# Altium schematic sheet MCU_DLS.SchDoc: DLS MCU
size A3; DrawnBy: Artur Bereit; Revision: 1.0; SheetNumber: 3; SheetTotal: 4; SPICEModelCacheRWZWSWZR: <root> / <DocumentId>RWZWSWZR</DocumentId> / <CacheFrame Number="0"> / <Model Name="0805_150080gs75000" Kind="CKT"> / <Text>****** / .subckt 0805_150080GS75000  1  2 / D1 1 2 SMCW / .MODEL SMCW D / + IS=906.98E-12 / + N=4.4982 / + RS=1.5743 / + IKF=518.93E-9 / + CJO=1.0000E-12 / + M=.3333 / + VJ=.75 / + BV=5 / + IBV=10.00E-6 / + TT=5.0000E-9 / .ends</Text> / </Model> / <Model Name="0805_150080as75000" Kind="CKT"> / <Text>****** / .subckt 0805_150080AS75000  1  2 / D1 1 2 SMCW / .MODEL SMCW D / + IS=10.010E-21 / + N=1.8643 / + RS=1.0000E-6 / + IKF=999 / + CJO=1.0000E-12 / + M=.3333 / + VJ=.75 / + BV=5 / + IBV=10.00E-6 / + TT=5.0000E-9 / .ends</Text> / </Model> / <Model Name="860020672011_22uf" Kind="CKT"> / <Text>******* / .subckt 860020672011_22uF 1 2 / Rser 1 3 0.725557254649 / Lser 2 4 4.139560626E-09 / C1 3 4 0.000022 / Rpar 3 4 4545454.54545455 / .ends 860020672011_22uF</Text> / </Model> / </CacheFrame> / </root>
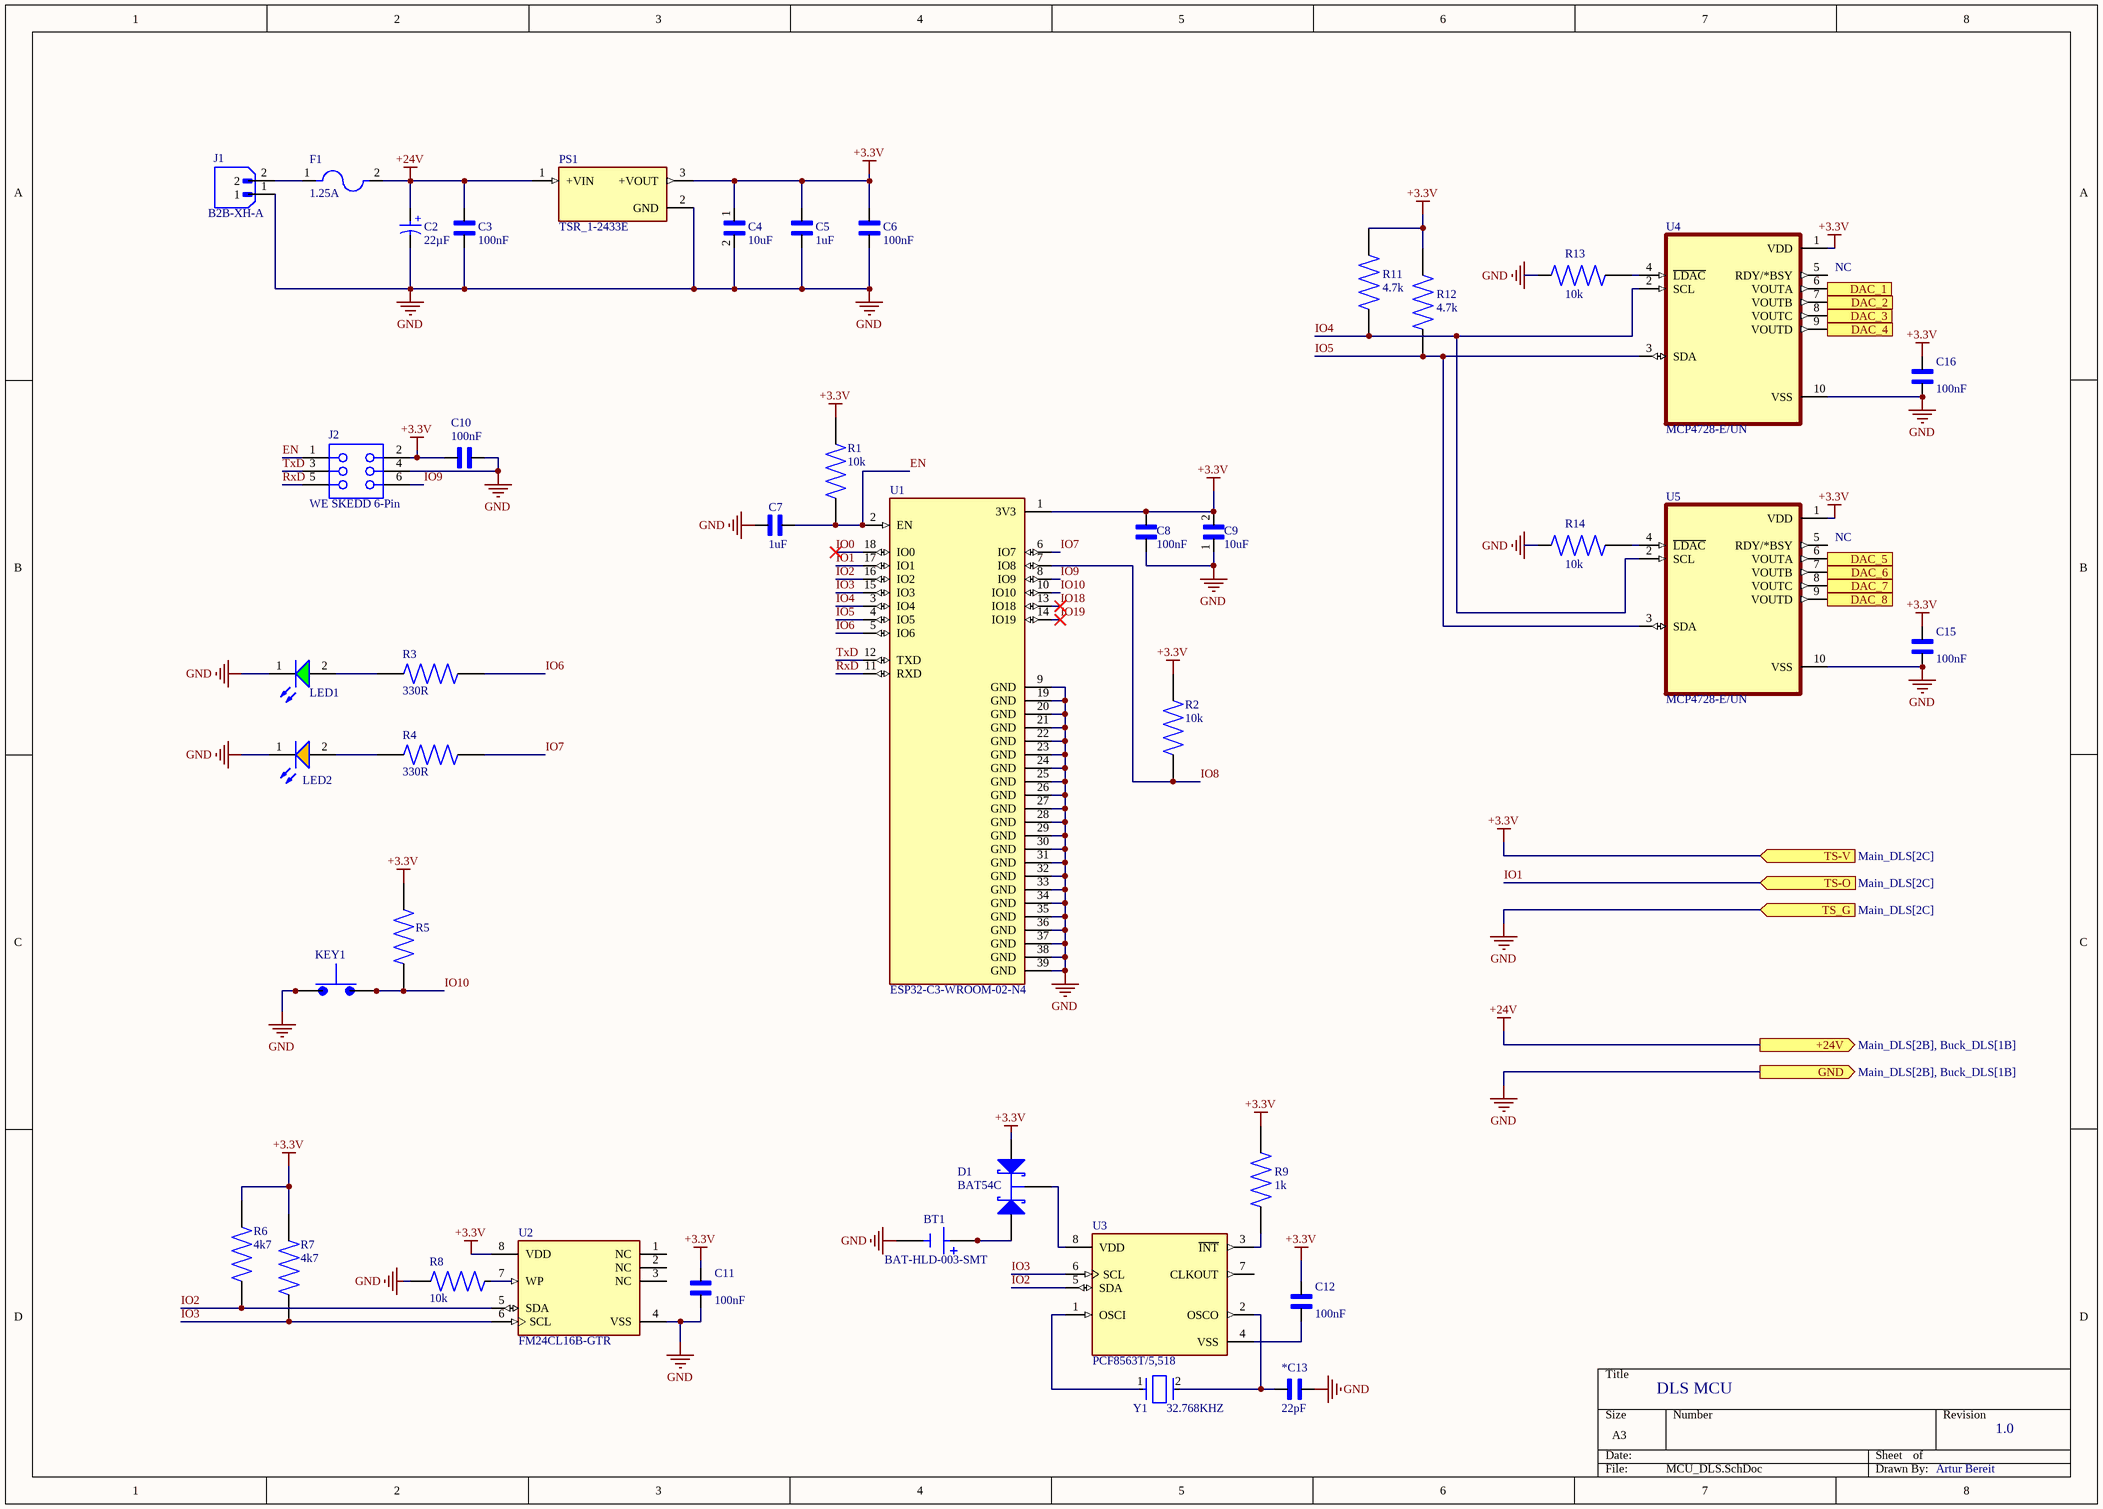
[diagram p0: MCU_DLS.SchDoc]

## Parts
*C13  22pF  [CAPC2012X94N]
BT1  BAT-HLD-003-SMT  [BAT_BAT-HLD-003-SMT]
C2  22µF  [WCAP-ATG5_D5H11]
C3  100nF  [CAPC2012X94N]
C4  10uF  [CAPC2012X145N]
C5  1uF  [CAPC2012X140N]
C6  100nF  [CAPC2012X94N]
C7  1uF  [CAPC2012X140N]
C8  100nF  [CAPC2012X94N]
C9  10uF  [CAPC2012X145N]
C10  100nF  [CAPC2012X94N]
C11  100nF  [CAPC2012X94N]
C12  100nF  [CAPC2012X94N]
C15  100nF  [CAPC2012X94N]
C16  100nF  [CAPC2012X94N]
D1  BAT54C  [NXP-SOT23-3_V]
F1  1.25A  [FUSC6125X279N]
J1  B2B-XH-A  [JST_B2B-XH-A_(LF)(SN)]
J2  WE SKEDD 6-Pin  [490107670612_Permanent Application]
KEY1  SKRPABE010  [SW_SKRPABE010]  (value not drawn)
LED1  Green  [WL-SMCW_0805_150080xx75000]  (value not drawn)
LED2  Amber, 2V, 140°  [WL-SMCW_0805_150080xx75000]  (value not drawn)
PS1  TSR_1-2433E  [CONV_TSR_1-2433E]
R1  10k  [RES_ERJ6ENF1002V]
R2  10k  [RES_ERJ6ENF1002V]
R3  330R  [RES_ERJ6ENF1002V]
R4  330R  [RES_ERJ6ENF1002V]
R5  ERJ6ENF1002V  [RES_ERJ6ENF1002V]  (value not drawn)
R6  4k7  [RES_ERJ6ENF1002V]
R7  4k7  [RES_ERJ6ENF1002V]
R8  10k  [RES_ERJ6ENF1002V]
R9  1k  [RES_ERJ6ENF1002V]
R11  4.7k  [RES_ERJ6ENF1002V]
R12  4.7k  [RES_ERJ6ENF1002V]
R13  10k  [RES_ERJ6ENF1002V]
R14  10k  [RES_ERJ6ENF1002V]
U1  ESP32-C3-WROOM-02-N4  [MODULE_ESP32-C3-WROOM-02-H4]
U2  FM24CL16B-GTR  [FP-51-85066-MFG]
U3  PCF8563T/5,518  [FP-SOT96-1-MFG]
U4  MCP4728-E/UN  [SOP50P490X110-10N]
U5  MCP4728-E/UN  [SOP50P490X110-10N]
Y1  32.768KHZ  [FP-ABS07-MFG]

## Ports
+24V (out, see Main_DLS[2B], Buck_DLS[1B]), DAC_1 (out, see Main_DLS[2B]), DAC_2 (out, see Main_DLS[2B]), DAC_3 (out, see Main_DLS[2B]), DAC_4 (out, see Main_DLS[2B]), DAC_5 (out, see Main_DLS[2B]), DAC_6 (out, see Main_DLS[2B]), DAC_7 (out, see Main_DLS[2C]), DAC_8 (out, see Main_DLS[2C]), GND (out, see Main_DLS[2B], Buck_DLS[1B]), TS-O (in, see Main_DLS[2C]), TS-V (in, see Main_DLS[2C]), TS_G (in, see Main_DLS[2C])

## Nets
+3.3V: C4.1 C5.2 C6.1 C8.2 C9.2 C10.1 C11.2 C12.2 C15.2 C16.2 D1.1(A) J2.2 PS1.3(+VOUT) R1.2 R2.2 R5.2 R6.1 R7.2 R9.2 R11.1 R12.1 U1.1(3V3) U2.8(VDD) U4.1(VDD) U5.1(VDD) ; port TS-V
+24V: C2.1(P) C3.2 F1.2 PS1.1(+VIN) ; port +24V
GND: *C13.1 BT1.N(NEG) C2.2(N) C3.1 C4.2 C5.1 C6.2 C7.1 C8.1 C9.1 C10.2 C11.1 C15.1 C16.1 J1.1 J2.4 KEY1.1 KEY1.2 LED1.1(K) LED2.1(K) PS1.2(GND) R8.1 R13.2 R14.2 U1.9(GND) U1.19(GND) U1.20(GND) U1.21(GND) U1.22(GND) U1.23(GND) U1.24(GND) U1.25(GND) U1.26(GND) U1.27(GND) U1.28(GND) U1.29(GND) U1.30(GND) U1.31(GND) U1.32(GND) U1.33(GND) U1.34(GND) U1.35(GND) U1.36(GND) U1.37(GND) U1.38(GND) U1.39(GND) U2.4(VSS) U4.10(VSS) U5.10(VSS) ; port TS_G, port GND
DAC_1: U4.6(VOUTA) ; port DAC_1
DAC_2: U4.7(VOUTB) ; port DAC_2
DAC_3: U4.8(VOUTC) ; port DAC_3
DAC_4: U4.9(VOUTD) ; port DAC_4
DAC_5: U5.6(VOUTA) ; port DAC_5
DAC_6: U5.7(VOUTB) ; port DAC_6
DAC_7: U5.8(VOUTC) ; port DAC_7
DAC_8: U5.9(VOUTD) ; port DAC_8
EN: C7.2 J2.1 R1.1 U1.2(EN)
IO0: U1.18(IO0)
IO1: U1.17(IO1) ; port TS-O
IO2: R6.2 U1.16(IO2) U2.5(SDA) U3.5(SDA)
IO3: R7.1 U1.15(IO3) U2.6(SCL) U3.6(SCL)
IO4: R11.2 U1.3(IO4) U4.2(SCL) U5.2(SCL)
IO5: R12.2 U1.4(IO5) U4.3(SDA) U5.3(SDA)
IO6: R3.2 U1.5(IO6)
IO7: R4.2 U1.6(IO7)
IO8: R2.1 U1.7(IO8)
IO9: J2.6 U1.8(IO9)
IO10: KEY1.3 KEY1.4 R5.1 U1.10(IO10)
IO18: U1.13(IO18)
IO19: U1.14(IO19)
RxD: J2.5 U1.11(RXD)
TxD: J2.3 U1.12(TXD)
Net*C13_2: *C13.2 U3.2(OSCO) Y1.2
NetBT1_P1: BT1.P1(POS) BT1.P2(POS) D1.2(A)
NetC12_1: C12.1 U3.4(VSS)
NetD1_3: D1.3(K) U3.8(VDD)
NetF1_1: F1.1 J1.2
NetLED1_2: LED1.2(A) R3.1
NetLED2_2: LED2.2(A) R4.1
NetR8_2: R8.2 U2.7(WP)
NetR9_1: R9.1 U3.3(~{INT})
NetR13_1: R13.1 U4.4(~{LDAC})
NetR14_1: R14.1 U5.4(~{LDAC})
NetU3_1: U3.1(OSCI) Y1.1

Not connected (* = marked no-connect by the designer): U2 1(NC) 2(NC) 3(NC); U3 7(CLKOUT); U4 5(RDY/*BSY); U5 5(RDY/*BSY)

## Notes on the sheet
- (near U4) NC
- (near U5) NC
- (in symbol 860020672011) +

## Library data of the parts
*C13 C3 C6 C8 C10-C12 C15 C16 = 08055C104KAT2A: Capacitor;Ceramic;0.1uF;10%;50V;Tape/Reel | AVX 08055C104KAT2A; SnapEDA_Link: https://www.snapeda.com/parts/08055C104KAT2A/AVX/view-part/?ref=snap; Package: 2012 AVX; Value: *; MF: AVX; MP: 08055C104KAT2A; Check_prices: https://www.snapeda.com/parts/08055C104KAT2A/AVX/view-part/?ref=eda
BT1 = BAT-HLD-003-SMT: Battery Holder Coin 20 SMT Nickel; MF: Linx Technologies Inc.; SnapEDA_Link: https://www.snapeda.com/parts/BAT-HLD-003-SMT/Linx/view-part/?ref=snap; Package: None; Value: *; MP: BAT-HLD-003-SMT; Check_prices: https://www.snapeda.com/parts/BAT-HLD-003-SMT/Linx/view-part/?ref=eda
C2 = 860020672011: WCAP-ATG5 Aluminum Electrolytic Capacitor, Radial, THT, D5 x H11mm, 22µF, 50V; Manufacturer: Wurth Elektronik; Capacitance Tolerance: +/-20%; Dissipation Factor: 10%; Endurance: 2000h; Leakage Current: 11µA; Ripple Current: 60mA; Technical Reference: ATDC110220M050DSPA3B000; Manufacturer Part Number: 860020672011; Category: Aluminum Electrolytic Capacitors; Match Code: WCAP-ATG5; ComponentLink1Description: Website Link; ComponentLink1URL: https://www.we-online.com/redexpert/article/860020672011?ad; ComponentLink2Description: Datasheet Link; ComponentLink2URL: https://www.we-online.com/redexpert/spec/860020672011?ad; Mount: Through Hole; Operating Temperature Max: 105°C; Operating Temperature Min: -40°C; Packaging: Ammo Pack; Height: 11mm; Diameter: 5mm; Capacitance: 22µF; Rated Voltage (DC): 50V
C4 = GCG21BR70J106KE01L: Package: None; Price: None; Value: *; MP: GCG21BR70J106KE01L; Availability: Unavailable
C5 C7 = GCM21BR71C105KA58L: SMD capacitor X7R(EIA) with capacitance 1.0uF Tol.10%. Rated voltage 16Vdc 125C; MF: Murata; SnapEDA_Link: https://www.snapeda.com/parts/GCM21BR71C105KA58L/Murata/view-part/?ref=snap; Package: 2012-2 Murata; Value: *; MP: GCM21BR71C105KA58L; Check_prices: https://www.snapeda.com/parts/GCM21BR71C105KA58L/Murata/view-part/?ref=eda
C9 = GRJ21BR61E106KE01K: Package: None; Price: None; Value: *; MP: GRJ21BR61E106KE01K; Availability: Unavailable
D1 = CMP-0417-00003-1: Schottky Barrier Diode, 30 V, 2 uA, -55 to 150 degC, 3-Pin SOT23, RoHS, Tape and Reel; Manufacturer: NXP Semiconductors; IR (uA): 2; VF (mV): 800; Trr (ns): 5; Cd (pF): 10; VR (V): 30; Rth(j-a) (K/W): 500; RoHS: TRUE; Packing: Tape and Reel; ComponentLink2URL: http://www.nxp.com/documents/data_sheet/BAT54_SER.pdf; PartNumber: BAT54C; ComponentLink2Description: Datasheet; Temperature Range: -55 to 150 degC; PackageReference: SOT23-3; PackageDescription: 3-Pin Plastic Surface-mounted Package, Body 1.3 x 2.9 mm, Pitch 0.95 mm; Mounting Technology: Surface Mount; ComponentLink1URL: http://www.nxp.com/; DatasheetVersion: Rev. 5; ComponentLink1Description: Manufacturer URL
F1 = 0679L1250-01: 2410 SMT Fuse | Quick Acting | 250mA | Higher AC Voltage; Package: None; Price: None; Value: *; MP: 0679L1250-01; Availability: Unavailable
J1 = B2B-XH-A_(LF)(SN): Connector Header Through Hole 2 position 0.098 (2.50mm); MF: JST Sales; MP: B2B-XH-A (LF)(SN); SnapEDA_Link: https://www.snapeda.com/parts/B2B-XH-A%20(LF)(SN)/JST+Sales+America+Inc./view-part/?ref=snap; Package: None; Value: *; Check_prices: https://www.snapeda.com/parts/B2B-XH-A%20(LF)(SN)/JST+Sales+America+Inc./view-part/?ref=eda
J2 = CMP-1502-02449-2: 490107670612; NexarPartId: 87855882; Contact Resistance: 10mΩ; Gender: Receptacle; Current Rating: 1A; Operating Supply Voltage: 500V; Number of Pins: 6; Lead Pitch: 2.54mm; RoHS: Non-Compliant
KEY1 = SKRPABE010: Switch Tactile N.O. SPST Button J-Bend 0.05A 16VDC 1.57N SMD Automotive T/R; MF: ALPS; SnapEDA_Link: https://www.snapeda.com/parts/SKRPABE010/ALPS/view-part/?ref=snap; Package: None; Value: *; MP: SKRPABE010; Check_prices: https://www.snapeda.com/parts/SKRPABE010/ALPS/view-part/?ref=eda
LED1 = 150080GS75000: WL-SMCW Mono-color Chip LED Waterclear, SMT, size 0805, Green, 3.2V, 140°; Manufacturer: Wurth Elektronik; Case/Size Code: 0805; Chip Technology: InGaN; Dominant Wavelength: 525nm; Luminous Intensity: 450mcd; Peak Wavelength: 515nm; Manufacturer Part Number: 150080GS75000; Category: Signal LEDs; Match Code: WL-SMCW; ComponentLink1Description: Website Link; ComponentLink1URL: https://www.we-online.com/redexpert/article/150080GS75000?ad; ComponentLink2Description: Datasheet Link; ComponentLink2URL: https://www.we-online.com/redexpert/spec/150080GS75000?ad; Mount: Surface Mount; Operating Temperature Max: 85°C; Operating Temperature Min: -40°C; Packaging: Tape and Reel; Length: 2mm; Width: 1.25mm; Height: 0.7mm; Emitting Color: Green; Forward Voltage: 3.2V; Viewing Angle: 140°
LED2 = 150080AS75000: WL-SMCW Mono-color Chip LED Waterclear, SMT, size 0805, Amber, 2V, 140°; Manufacturer: Wurth Elektronik; Case/Size Code: 0805; Chip Technology: AlInGaP; Dominant Wavelength: 605nm; Luminous Intensity: 130mcd; Peak Wavelength: 610nm; Manufacturer Part Number: 150080AS75000; Category: Signal LEDs; Match Code: WL-SMCW; ComponentLink1Description: Website Link; ComponentLink1URL: https://www.we-online.com/redexpert/article/150080AS75000?ad; ComponentLink2Description: Datasheet Link; ComponentLink2URL: https://www.we-online.com/redexpert/spec/150080AS75000?ad; Mount: Surface Mount; Operating Temperature Max: 85°C; Operating Temperature Min: -40°C; Packaging: Tape and Reel; Length: 2mm; Width: 1.25mm; Height: 0.7mm; Emitting Color: Amber; Forward Voltage: 2V; Viewing Angle: 140°
PS1 = TSR_1-2433E: 1 Amp POL converter, industrial, wide input range, pos.-pos. circuit, cost efficient, LM78 compatible, SIP-3; MF: Traco Power; MP: TSR 1-2433E; SnapEDA_Link: https://www.snapeda.com/parts/TSR%201-2433E/Traco+Power/view-part/?ref=snap; Package: NON STANDARD-3 Traco Power; Value: *; Check_prices: https://www.snapeda.com/parts/TSR%201-2433E/Traco+Power/view-part/?ref=eda
R1 R2 R5-R8 R11-R14 = ERJ6ENF1002V: 10 kOhms Â±1% 0.125W, 1/8W Chip Resistor 0805 (2012 Metric) Automotive AEC-Q200 Thick Film; MF: Panasonic; Check_prices: https://www.snapeda.com/parts/ERJ6ENF1002V/Panasonic/view-part/5776803/?ref=eda; SnapEDA_Link: https://www.snapeda.com/parts/ERJ6ENF1002V/Panasonic/view-part/5776803/?ref=snap; Value: *; Digi-Key_Part_Number: P10.0KCCT-ND; MP: ERJ6ENF1002V; Package: 2012-2 Panasonic
R3 = ERJ6ENF1002V: 330Ohms Â±1% 0.125W, 1/8W Chip Resistor 0805 (2012 Metric) Automotive AEC-Q200 Thick Film; MF: Panasonic; Check_prices: https://www.snapeda.com/parts/ERJ6ENF1002V/Panasonic/view-part/5776803/?ref=eda; SnapEDA_Link: https://www.snapeda.com/parts/ERJ6ENF1002V/Panasonic/view-part/5776803/?ref=snap; Value: *; Digi-Key_Part_Number: P10.0KCCT-ND; MP: ERJ6ENF1002V; Package: 2012-2 Panasonic
R4 = ERJ6ENF1002V: 330R Â±1% 0.125W, 1/8W Chip Resistor 0805 (2012 Metric) Automotive AEC-Q200 Thick Film; MF: Panasonic; Check_prices: https://www.snapeda.com/parts/ERJ6ENF1002V/Panasonic/view-part/5776803/?ref=eda; SnapEDA_Link: https://www.snapeda.com/parts/ERJ6ENF1002V/Panasonic/view-part/5776803/?ref=snap; Value: *; Digi-Key_Part_Number: P10.0KCCT-ND; MP: ERJ6ENF1002V; Package: 2012-2 Panasonic
R9 = ERJ6ENF1002V: 1 kOhms Â±1% 0.125W, 1/8W Chip Resistor 0805 (2012 Metric) Automotive AEC-Q200 Thick Film; MF: Panasonic; Check_prices: https://www.snapeda.com/parts/ERJ6ENF1002V/Panasonic/view-part/5776803/?ref=eda; SnapEDA_Link: https://www.snapeda.com/parts/ERJ6ENF1002V/Panasonic/view-part/5776803/?ref=snap; Value: *; Digi-Key_Part_Number: P10.0KCCT-ND; MP: ERJ6ENF1002V; Package: 2012-2 Panasonic
U1 = ESP32-C3-WROOM-02-N4: WiFi Modules (802.11) (Engineering Samples) SMD module, ESP32-C3, 4MB SPI flash, PCB antenna, -40 C +85 C; MF: Espressif Systems; Value: *; SnapEDA_Link: https://www.snapeda.com/parts/ESP32-C3-WROOM-02-N4/Espressif+Systems/view-part/?ref=snap; Purchase-URL: https://pricing.snapeda.com/search/part/ESP32-C3-WROOM-02-N4/?ref=eda; Availability: In Stock; Price: None; Package: Package; Check_prices: https://www.snapeda.com/parts/ESP32-C3-WROOM-02-N4/Espressif+Systems/view-part/?ref=eda; MP: ESP32-C3-WROOM-02-N4
U2 = CMP-12945-000019-1: IC FRAM 16K I2C 1MHZ 8SOIC; Data Bus Width: 8b; Memory Type: RAM; Memory Size: 16KB; Max Supply Voltage: 3.65V; Operating Supply Voltage: 3V; Nominal Supply Current: 300uA; Access Time: 550ns; Min Supply Voltage: 2.7V; Package Quantity: 2500; Max Operating Temperature: 85°C; Interface: I2C; Contact Plating: Tin; Lead Free: Lead Free; Mount: Surface Mount; Word Size: 8b; Number of Pins: 8; Frequency: 1MHz; Density: 16Kb; Case/Package: SOIC; Packaging: Tape and Reel; Min Operating Temperature: -40°C
U3 = CMP-10083-000010-1: IC RTC CLK/CALENDAR I2C 8-SOIC; Manufacturer: NXP; Nominal Supply Current: 0.225-0.95uA; Interface: I2C,2-Wire; Min Supply Voltage: 1V; Frequency: 400kHz; Standoff Height: 0.1mm; Number Of Outputs: 1; Max Supply Voltage: 5.5V; Digikey Description: IC RTC CLK/CALENDAR I2C 8-SOIC; Height: 1.75mm; Temperature: -40°C to +85°C; Category: IC; Package: SOT96-1; Ambient Temperature Range High: +85°C; Octopart: https://octopart.com/pcf8563t%2F5%2C518-nxp+semiconductors-19647995; Footprint Url: https://www.nxp.com/docs/en/package-information/SOT96-1.pdf; ComponentLink2URL: https://www.nxp.com/docs/en/data-sheet/PCF8563.pdf; RoHS: TRUE; ComponentLink2Description: Datasheet; Lead Free: Yes; Temperature Range Low: -40°C; Ambient Temperature Range Low: -40°C; Manufacturer Part Number: PCF8563T/5,518; Device Class L3: Real Time Clocks; Temperature Range High: +85°C; Automotive: No; Device Class L2: Clock and Timing; Mouser Description: Real Time Clock Binary I2C 1-5V RTC IC; Device Class L1: Integrated Circuits (ICs)
U4 U5 = MCP4728-E/UN: Microchip 4-channel 12 bit Serial DAC 10-Pin MSOP | Microchip Technology Inc. MCP4728-E/UN; SnapEDA_Link: https://www.snapeda.com/parts/MCP4728-E/UN/Microchip/view-part/?ref=snap; Package: MSOP-10 Microchip; Value: *; MF: Microchip; MP: MCP4728-E/UN; Check_prices: https://www.snapeda.com/parts/MCP4728-E/UN/Microchip/view-part/?ref=eda
Y1 = CMP-27762-014373-1: Crystal 32.768kHz ±20ppm (Tol) 7pF FUND 70kΩ 2-Pin CSMD T/R; Insulation Resistance: 500MR; Series Resistance: 70kR; Mount: Surface Mount; Tolerance: 20ppm; Length: 3.2mm; Lead Free: Lead Free; Frequency: 32.768kHz; Frequency Tolerance: 20ppm; Frequency Stability: 20ppm; Load Capacitance: 7pF; Radiation Hardening: No; Package Quantity: 3000; Width: 1.5mm; Height: 0.9mm; Termination: SMD/SMT; Max Operating Temperature: 85°C; Number of Pins: 2; Operating Frequency: 32.768 kHz; ESR (Equivalent Series Resistance): 70kR; Packaging: Tape and Reel; Series: ABS07; Min Operating Temperature: -40°C; Depth: 1.5mm; Case/Package: CSMD